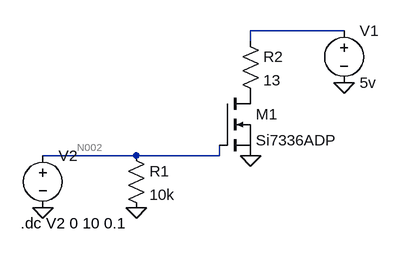
[diagram p0: schematic sim.asc]
sim.asc, the LTspice schematic file:
Version 4
SHEET 1 880 680
WIRE 368 -16 224 -16
WIRE 224 0 224 -16
WIRE 48 176 -96 176
WIRE 176 176 176 160
WIRE 176 176 48 176
FLAG 48 256 0
FLAG 224 176 0
FLAG 368 64 0
FLAG -96 256 0
SYMBOL nmos 176 80 R0
SYMATTR InstName M1
SYMATTR Value Si7336ADP
SYMBOL res 32 160 R0
SYMATTR InstName R1
SYMATTR Value 10k
SYMBOL res 208 -16 R0
SYMATTR InstName R2
SYMATTR Value 13
SYMBOL voltage 368 -32 R0
WINDOW 123 0 0 Left 0
WINDOW 39 0 0 Left 0
SYMATTR InstName V1
SYMATTR Value 5v
SYMBOL voltage -96 160 R0
WINDOW 123 0 0 Left 0
WINDOW 39 0 0 Left 0
SYMATTR InstName V2
SYMATTR Value ""
TEXT -130 280 Left 2 !.dc V2 0 10 0.1

The netlist it stands for:
* sim.asc
M1 P001 N002 0 0 Si7336ADP
R1 N002 0 10k
R2 N001 P001 13
V1 N001 0 5v
V2 N002 0
.model NMOS NMOS
.model PMOS PMOS
.lib standard.mos
.dc V2 0 10 0.1
.backanno
.end

* Results of the author's LTspice run, read from the files saved beside the schematic
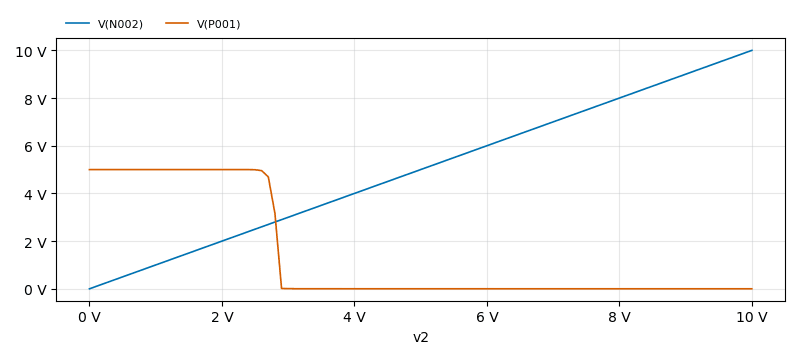
[diagram p1: DC transfer characteristic of sim.asc, plotted from the saved traces]
* DC transfer characteristic, 1 run:
*   V(N002): 0 V at v2=0 V, 10 V at v2=10 V, min 0 V, max 10 V
*   V(P001): 5 V at v2=0 V, 870.9 µV at v2=10 V, min 870.9 µV, max 5 V